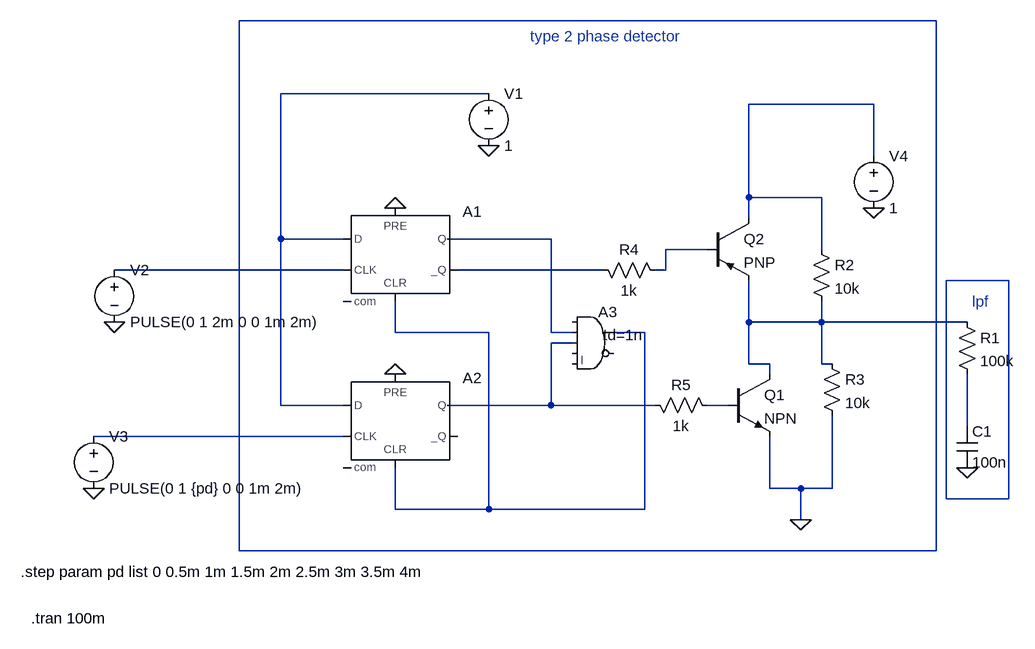
[diagram p0: schematic phasedetector2.asc]
phasedetector2.asc, the LTspice schematic file:
Version 4
SHEET 1 880 680
WIRE 688 -304 -384 -304
WIRE 0 -192 -320 -192
WIRE 592 -176 400 -176
WIRE 592 -96 592 -176
WIRE 400 -32 400 -176
WIRE 512 -32 400 -32
WIRE 400 0 400 -32
WIRE -320 32 -320 -192
WIRE -224 32 -320 32
WIRE 96 32 -64 32
WIRE 336 48 272 48
WIRE 512 48 512 -32
WIRE -224 80 -576 80
WIRE 176 80 -48 80
WIRE 272 80 272 48
WIRE 272 80 256 80
WIRE 800 96 704 96
WIRE 400 160 400 96
WIRE 512 160 512 128
WIRE 512 160 400 160
WIRE 736 160 512 160
WIRE -144 176 -144 128
WIRE 0 176 -144 176
WIRE 96 176 96 32
WIRE 128 176 96 176
WIRE 240 176 192 176
WIRE 128 192 96 192
WIRE 400 224 400 160
WIRE 432 224 400 224
WIRE 512 224 512 160
WIRE 528 224 512 224
WIRE 432 240 432 224
WIRE -320 288 -320 32
WIRE -224 288 -320 288
WIRE 96 288 96 192
WIRE 96 288 -64 288
WIRE 256 288 96 288
WIRE 368 288 336 288
WIRE 736 320 736 240
WIRE -224 336 -608 336
WIRE 432 416 432 336
WIRE 480 416 432 416
WIRE 528 416 528 304
WIRE 528 416 480 416
WIRE 704 432 704 96
WIRE 800 432 800 96
WIRE 800 432 704 432
WIRE -144 448 -144 384
WIRE 0 448 0 176
WIRE 0 448 -144 448
WIRE 240 448 240 176
WIRE 240 448 0 448
WIRE 480 464 480 416
WIRE -384 512 -384 -304
WIRE 688 512 688 -304
WIRE 688 512 -384 512
FLAG -576 160 0
FLAG -608 416 0
FLAG 0 -112 0
FLAG 592 -16 0
FLAG 736 384 0
FLAG 480 464 0
FLAG -144 -16 0
FLAG -144 240 0
SYMBOL Digital\\dflop -144 -16 R0
SYMATTR InstName A1
SYMBOL Digital\\dflop -144 240 R0
SYMATTR InstName A2
SYMBOL npn 368 240 R0
SYMATTR InstName Q1
SYMBOL pnp 336 0 R0
SYMATTR InstName Q2
SYMBOL voltage 0 -208 R0
WINDOW 123 0 0 Left 0
WINDOW 39 0 0 Left 0
SYMATTR InstName V1
SYMATTR Value 1
SYMBOL voltage -576 64 R0
WINDOW 123 0 0 Left 0
WINDOW 39 0 0 Left 0
SYMATTR InstName V2
SYMATTR Value PULSE(0 1 2m 0 0 1m 2m)
SYMBOL voltage -608 320 R0
WINDOW 123 0 0 Left 0
WINDOW 39 0 0 Left 0
SYMATTR InstName V3
SYMATTR Value PULSE(0 1 {pd} 0 0 1m 2m)
SYMBOL voltage 592 -112 R0
WINDOW 123 0 0 Left 0
WINDOW 39 0 0 Left 0
SYMATTR InstName V4
SYMATTR Value 1
SYMBOL res 720 144 R0
SYMATTR InstName R1
SYMATTR Value 100k
SYMBOL cap 720 320 R0
SYMATTR InstName C1
SYMATTR Value 100n
SYMBOL Digital\\and 160 128 R0
WINDOW 3 16 52 Left 2
SYMATTR InstName A3
SYMATTR Value td=1n
SYMBOL res 496 32 R0
SYMATTR InstName R2
SYMATTR Value 10k
SYMBOL res 512 208 R0
SYMATTR InstName R3
SYMATTR Value 10k
SYMBOL res 160 64 M90
WINDOW 0 0 56 VBottom 2
WINDOW 3 32 56 VTop 2
SYMATTR InstName R4
SYMATTR Value 1k
SYMBOL res 240 272 M90
WINDOW 0 0 56 VBottom 2
WINDOW 3 32 56 VTop 2
SYMATTR InstName R5
SYMATTR Value 1k
TEXT -720 544 Left 2 !.step param pd list 0 0.5m 1m 1.5m 2m 2.5m 3m 3.5m 4m
TEXT 744 128 Left 2 ;lpf
TEXT 64 -280 Left 2 ;type 2 phase detector
TEXT -704 616 Left 2 !.tran 100m

The netlist it stands for:
* phasedetector2.asc
A1 N002 0 N006 0 N010 N007 N004 0 DFLOP
A2 N002 0 N014 0 N010 0 N011 0 DFLOP
Q1 N009 N012 0 0 NPN
Q2 N003 N005 N009 0 PNP
V1 N002 0 1
V2 N006 0 PULSE(0 1 2m 0 0 1m 2m)
V3 N014 0 PULSE(0 1 {pd} 0 0 1m 2m)
V4 N003 0 1
R1 N009 N013 100k
C1 N013 0 100n
A3 0 N004 N011 0 0 0 N010 0 AND td=1n
R2 N003 N009 10k
R3 N009 0 10k
R4 N007 N005 1k
R5 N011 N012 1k
.model NPN NPN
.model PNP PNP
.lib standard.bjt
.step param pd list 0 0.5m 1m 1.5m 2m 2.5m 3m 3.5m 4m
* lpf
* type 2 phase detector
.tran 100m
.backanno
.end